# Altium schematic sheet RGB Video Output.SchDoc: SNES TST
size A4; DrawnBy: Opatus; DocumentNumber: 4; Revision: 0; SheetNumber: 4; SheetTotal: 4
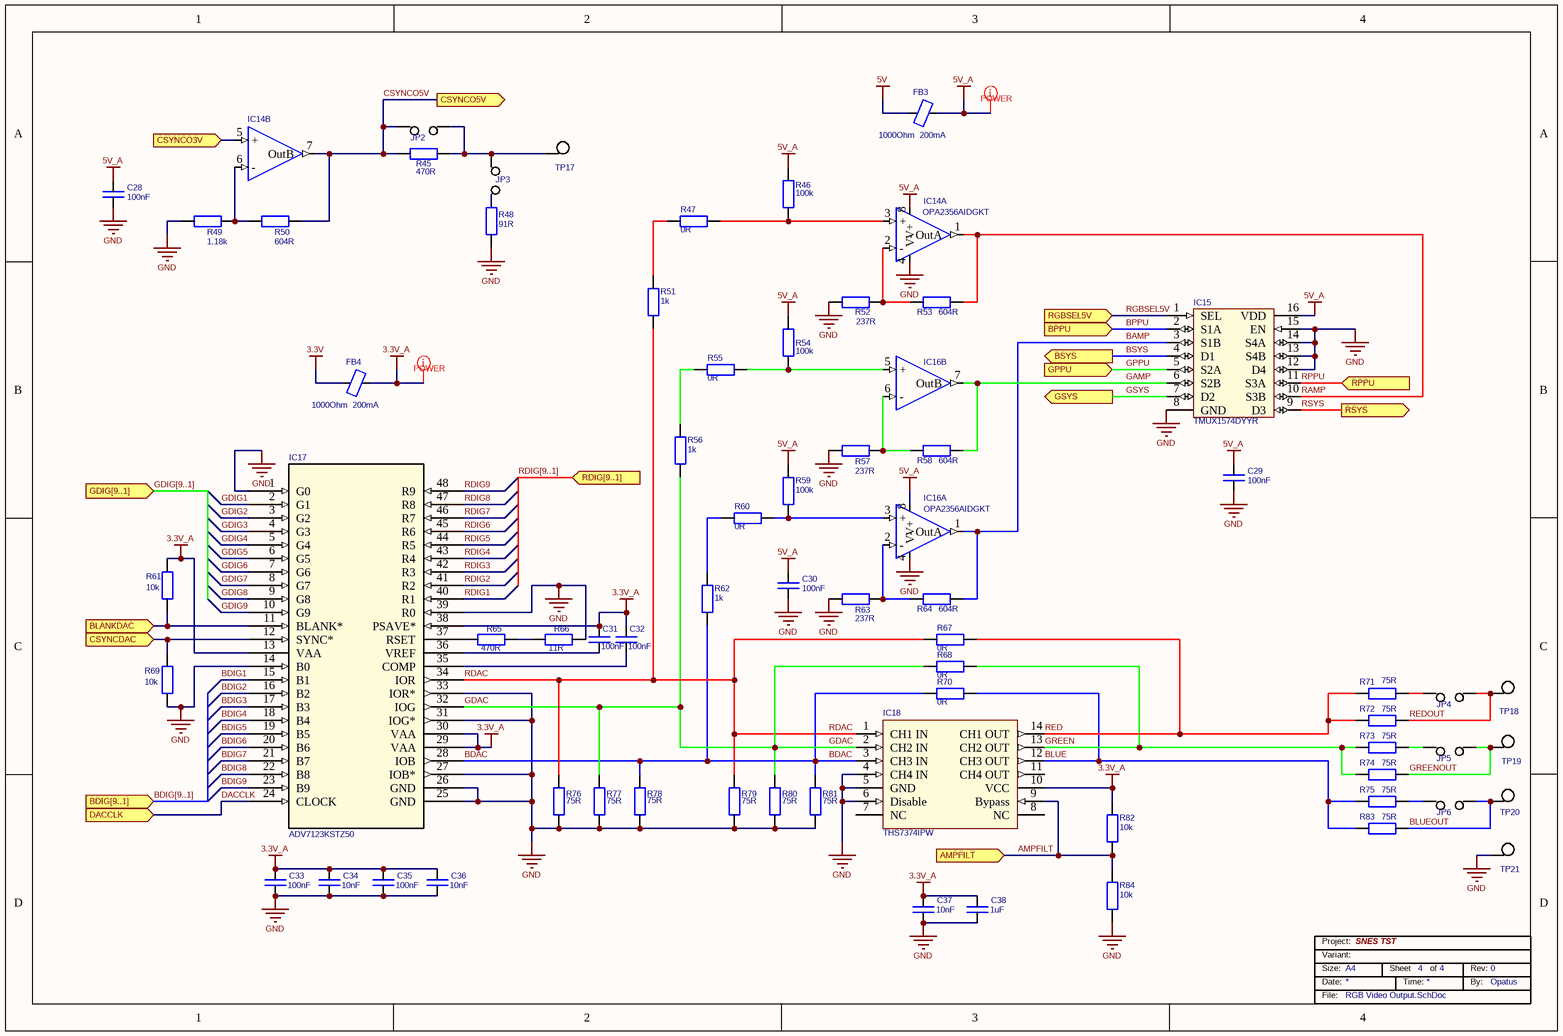
[diagram p0: RGB Video Output.SchDoc]

## Parts
C28  value 100nF  [Cap_0402_Chip]  (hidden comment: Ceramic Capacitor 100nF 10V ±20% X7R 0402)
C29  value 100nF  [Cap_0402_Chip]  (hidden comment: Ceramic Capacitor 100nF 10V ±20% X7R 0402)
C30  value 100nF  [Cap_0402_Chip]  (hidden comment: Ceramic Capacitor 100nF 10V ±20% X7R 0402)
C31  value 100nF  [Cap_0402_Chip]  (hidden comment: Ceramic Capacitor 100nF 10V ±20% X7R 0402)
C32  value 100nF  [Cap_0402_Chip]  (hidden comment: Ceramic Capacitor 100nF 10V ±20% X7R 0402)
C33  value 100nF  [Cap_0402_Chip]  (hidden comment: Ceramic Capacitor 100nF 10V ±20% X7R 0402)
C34  value 10nF  [Cap_0402_Chip]  (hidden comment: Ceramic Capacitor 10nF 10V ±20% X7R 0402)
C35  value 100nF  [Cap_0402_Chip]  (hidden comment: Ceramic Capacitor 100nF 10V ±20% X7R 0402)
C36  value 10nF  [Cap_0402_Chip]  (hidden comment: Ceramic Capacitor 10nF 10V ±20% X7R 0402)
C37  value 10nF  [Cap_0402_Chip]  (hidden comment: Ceramic Capacitor 10nF 10V ±20% X7R 0402)
C38  value 1uF  [Cap_0603_Chip]  (hidden comment: Ceramic Capacitor 1uF 10V ±20% X7R 0603)
FB3  1000Ohm  200mA  [Ind_0402_Chip]
FB4  1000Ohm  200mA  [Ind_0402_Chip]
IC14  Manufacturer_Part_Number: OPA2356AIDGKT  [MSOP8]  (hidden comment: OPA2356)  (parts A,B of 2)
IC15  Manufacturer_Part_Number: TMUX1574DYYR  [SOT-23THIN16]  (hidden comment: TMUX1574)
IC16  Manufacturer_Part_Number: OPA2356AIDGKT  [MSOP8]  (hidden comment: OPA2356)  (parts A,B of 2)
IC17  Manufacturer_Part_Number: ADV7123KSTZ50  [ST_48_ADI]  (hidden comment: ADV7123)
IC18  Manufacturer_Part_Number: THS7374IPW  [TSSOP14]  (hidden comment: THS7374)
JP2  Jumper  [Jumper]  (value not drawn)  (no BOM)
JP3  Jumper  [Jumper]  (value not drawn)  (no BOM)
JP4  Jumper  [Jumper]  (value not drawn)  (no BOM)
JP5  Jumper  [Jumper]  (value not drawn)  (no BOM)
JP6  Jumper  [Jumper]  (value not drawn)  (no BOM)
R45  value 470R  [Res_0603_Chip]  (hidden comment: Resistor 470R 0603 ±1%)
R46  value 100k  [Res_0402_Chip]  (hidden comment: Resistor 100k 0402 ±1%)
R47  value 0R  [Res_0402_Chip]  (hidden comment: Resistor 0R 0402)
R48  value 91R  [Res_0603_Chip]  (hidden comment: Resistor 91R 0603 ±1%)
R49  value 1.18k  [Res_0402_Chip]  (hidden comment: Resistor 1.18k 0402 ±1%)
R50  value 604R  [Res_0402_Chip]  (hidden comment: Resistor 604R 0402 ±1%)
R51  value 1k  [Res_0402_Chip]  (hidden comment: Resistor 1k 0402 ±1%)
R52  value 237R  [Res_0402_Chip]  (hidden comment: Resistor 237R 0402 ±1%)
R53  value 604R  [Res_0402_Chip]  (hidden comment: Resistor 604R 0402 ±1%)
R54  value 100k  [Res_0402_Chip]  (hidden comment: Resistor 100k 0402 ±1%)
R55  value 0R  [Res_0402_Chip]  (hidden comment: Resistor 0R 0402)
R56  value 1k  [Res_0402_Chip]  (hidden comment: Resistor 1k 0402 ±1%)
R57  value 237R  [Res_0402_Chip]  (hidden comment: Resistor 237R 0402 ±1%)
R58  value 604R  [Res_0402_Chip]  (hidden comment: Resistor 604R 0402 ±1%)
R59  value 100k  [Res_0402_Chip]  (hidden comment: Resistor 100k 0402 ±1%)
R60  value 0R  [Res_0402_Chip]  (hidden comment: Resistor 0R 0402)
R61  value 10k  [Res_0402_Chip]  (hidden comment: Resistor 10k 0402 ±1%)
R62  value 1k  [Res_0402_Chip]  (hidden comment: Resistor 1k 0402 ±1%)
R63  value 237R  [Res_0402_Chip]  (hidden comment: Resistor 237R 0402 ±1%)
R64  value 604R  [Res_0402_Chip]  (hidden comment: Resistor 604R 0402 ±1%)
R65  value 470R  [Res_0402_Chip]  (hidden comment: Resistor 470R 0402 ±1%)
R66  value 11R  [Res_0402_Chip]  (hidden comment: Resistor 11R 0402 ±1%)
R67  value 0R  [Res_0402_Chip]  (hidden comment: Resistor 0R 0402)
R68  value 0R  [Res_0402_Chip]  (hidden comment: Resistor 0R 0402)
R69  value 10k  [Res_0402_Chip]  (hidden comment: Resistor 10k 0402 ±1%)
R70  value 0R  [Res_0402_Chip]  (hidden comment: Resistor 0R 0402)
R71  value 75R  [Res_0603_Chip]  (hidden comment: Resistor 75R 0603 ±1%)
R72  value 75R  [Res_0603_Chip]  (hidden comment: Resistor 75R 0603 ±1%)
R73  value 75R  [Res_0603_Chip]  (hidden comment: Resistor 75R 0603 ±1%)
R74  value 75R  [Res_0603_Chip]  (hidden comment: Resistor 75R 0603 ±1%)
R75  value 75R  [Res_0603_Chip]  (hidden comment: Resistor 75R 0603 ±1%)
R76  value 75R  [Res_0402_Chip]  (hidden comment: Resistor 75R 0402 ±1%)
R77  value 75R  [Res_0402_Chip]  (hidden comment: Resistor 75R 0402 ±1%)
R78  value 75R  [Res_0402_Chip]  (hidden comment: Resistor 75R 0402 ±1%)
R79  value 75R  [Res_0402_Chip]  (hidden comment: Resistor 75R 0402 ±1%)
R80  value 75R  [Res_0402_Chip]  (hidden comment: Resistor 75R 0402 ±1%)
R81  value 75R  [Res_0402_Chip]  (hidden comment: Resistor 75R 0402 ±1%)
R82  value 10k  [Res_0402_Chip]  (hidden comment: Resistor 10k 0402 ±1%)
R83  value 75R  [Res_0603_Chip]  (hidden comment: Resistor 75R 0603 ±1%)
R84  value 10k  [Res_0402_Chip]  (hidden comment: Resistor 10k 0402 ±1%)
TP17  Pin Connector  [Pin Connector Small]  (value not drawn)  (no BOM)
TP18  Pin Connector  [Pin Connector Small]  (value not drawn)  (no BOM)
TP19  Pin Connector  [Pin Connector Small]  (value not drawn)  (no BOM)
TP20  Pin Connector  [Pin Connector Small]  (value not drawn)  (no BOM)
TP21  Pin Connector  [Pin Connector Small]  (value not drawn)  (no BOM)

## Ports
AMPFILT (in), BDIG[9..1] (in), BLANKDAC (in), BPPU (in), BSYS (out), CSYNCDAC (in), CSYNCO3V (in), CSYNCO5V (out), DACCLK (in), GDIG[9..1] (in), GPPU (in), GSYS (out), RDIG[9..1] (in), RGBSEL5V (in), RPPU (in), RSYS (out)

## Nets
3.3V: FB4.1
3.3V_A: C31.1 C32.1 C33.2 C34.2 C35.2 C36.2 C37.2 C38.2 FB4.2 IC17.13(VAA) IC17.29(VAA) IC17.30(VAA) IC17.38(PSAVE*) IC18.10(VCC) R61.2 R82.1
5V: FB3.1
5V_A: C28.1 C29.1 C30.1 FB3.2 IC14.8(V+) IC15.16(VDD) IC16.8(V+) R46.2 R54.2 R59.2
GND: C28.2 C29.2 C30.2 C33.1 C34.1 C35.1 C36.1 C37.1 C38.1 IC14.4(V-) IC15.8(GND) IC15.12(D4) IC15.13(S4B) IC15.14(S4A) IC15.15(EN) IC16.4(V-) IC17.1(G0) IC17.14(B0) IC17.25(GND) IC17.26(GND) IC17.27(IOB*) IC17.31(IOG*) IC17.33(IOR*) IC17.39(R0) IC18.4(CH4_IN) IC18.5(GND) IC18.6(Disable) R48.1 R49.1 R52.1 R57.1 R63.2 R66.2 R69.1 R76.1 R77.1 R78.1 R79.1 R80.1 R81.1 R84.2 TP21.1
AMPFILT: IC18.9(Bypass) R82.2 R84.1 ; port AMPFILT
BAMP: IC15.3(S1B) IC16.1(OutA) R64.2
BDAC: IC17.28(IOB) IC18.3(CH3_IN) R62.2 R70.2 R78.2 R81.2
BDIG1: IC17.15(B1)
BDIG2: IC17.16(B2)
BDIG3: IC17.17(B3)
BDIG4: IC17.18(B4)
BDIG5: IC17.19(B5)
BDIG6: IC17.20(B6)
BDIG7: IC17.21(B7)
BDIG8: IC17.22(B8)
BDIG9: IC17.23(B9)
BLANKDAC: IC17.11(BLANK*) R61.1 ; port BLANKDAC
BLUE: IC18.12(CH3_OUT) R70.1 R75.1 R83.1
BLUEOUT: JP6.1 R83.2 TP20.1
BPPU: IC15.2(S1A) ; port BPPU
BSYS: IC15.4(D1) ; port BSYS
CSYNCDAC: IC17.12(SYNC*) R69.2 ; port CSYNCDAC
CSYNCO3V: IC14.5(+) ; port CSYNCO3V
CSYNCO5V: IC14.7(OutB) JP2.2 R45.1 R50.1 ; port CSYNCO5V
DACCLK: IC17.24(CLOCK) ; port DACCLK
GAMP: IC15.6(S2B) IC16.7(OutB) R58.1
GDAC: IC17.32(IOG) IC18.2(CH2_IN) R56.2 R68.2 R77.2 R80.2
GDIG1: IC17.2(G1)
GDIG2: IC17.3(G2)
GDIG3: IC17.4(G3)
GDIG4: IC17.5(G4)
GDIG5: IC17.6(G5)
GDIG6: IC17.7(G6)
GDIG7: IC17.8(G7)
GDIG8: IC17.9(G8)
GDIG9: IC17.10(G9)
GPPU: IC15.5(S2A) ; port GPPU
GREEN: IC18.13(CH2_OUT) R68.1 R73.1 R74.1
GREENOUT: JP5.1 R74.2 TP19.1
GSYS: IC15.7(D2) ; port GSYS
RAMP: IC14.1(OutA) IC15.10(S3B) R53.2
RDAC: IC17.34(IOR) IC18.1(CH1_IN) R51.2 R67.2 R76.2 R79.2
RDIG1: IC17.40(R1)
RDIG2: IC17.41(R2)
RDIG3: IC17.42(R3)
RDIG4: IC17.43(R4)
RDIG5: IC17.44(R5)
RDIG6: IC17.45(R6)
RDIG7: IC17.46(R7)
RDIG8: IC17.47(R8)
RDIG9: IC17.48(R9)
RED: IC18.14(CH1_OUT) R67.1 R71.1 R72.1
REDOUT: JP4.1 R72.2 TP18.1
RGBSEL5V: IC15.1(SEL) ; port RGBSEL5V
RPPU: IC15.11(S3A) ; port RPPU
RSYS: IC15.9(D3) ; port RSYS
NetC31_2: C31.2 IC17.36(VREF)
NetC32_2: C32.2 IC17.35(COMP)
NetIC14_2: IC14.2(-) R52.2 R53.1
NetIC14_3: IC14.3(+) R46.1 R47.1
NetIC14_6: IC14.6(-) R49.2 R50.2
NetIC16_2: IC16.2(-) R63.1 R64.1
NetIC16_3: IC16.3(+) R59.1 R60.1
NetIC16_5: IC16.5(+) R54.1 R55.1
NetIC16_6: IC16.6(-) R57.2 R58.2
NetIC17_37: IC17.37(RSET) R65.1
NetJP2_1: JP2.1 JP3.1 R45.2 TP17.1
NetJP3_2: JP3.2 R48.2
NetJP4_2: JP4.2 R71.2
NetJP5_2: JP5.2 R73.2
NetJP6_2: JP6.2 R75.2
NetR47_2: R47.2 R51.1
NetR55_2: R55.2 R56.1
NetR60_2: R60.2 R62.1
NetR65_2: R65.2 R66.1

Not connected (* = marked no-connect by the designer): IC18 7(NC) 8(NC) 11(CH4_OUT)

## Buses and harness runs
bus BDIG[9..1] = port BDIG[9..1]
bus GDIG[9..1] = port GDIG[9..1]
bus RDIG[9..1] = port RDIG[9..1]

## Layout directives
net class POWER: 3.3V_A, 5V_A

## Notes on the sheet
- Size:
- Date:
- Variant:
- Project:
- A4
- Sheet
- Time:
- of
- Rev:
- By:
- File:

## Library data of the parts
C28-C37 = Capacitor: ChipSize: 0402; NominalVoltage: 10V; Dielectric: X7R; Tolerance: ±20%; PartType: Ceramic Capacitor
C38 = Capacitor: ChipSize: 0603; NominalVoltage: 10V; Dielectric: X7R; Tolerance: ±20%; PartType: Ceramic Capacitor
FB3 FB4 = Ferrite Bead: Manufacturer_Part_Number: MMZ1005S102CT000; Vendor: TDK; Value: 1000Ohm  200mA
IC14 IC16 = OPA2356: Vendor: Analog Devices
IC15 = TMUX1574: SPDT 4 Ch; Vendor: Texas Instruments
IC17 = ADV7123KSTZ140: 10Bit Video DAC; Vendor: Analog Devices Inc; Built_By: EMA_UL_Team; SourceLibrary: Analog_2012-01-01_8; Copyright: Copyright (C) 2018 Accelerated Designs. All rights reserved; RefDes: RefDes; Type: DEV
IC18 = THS7374: Vendor: Texas Instruments
R45 R48 R71-R75 R83 = R: ChipSize: 0603; Tolerance: ±1%; PartType: Resistor
R46 R47 R49-R70 R76-R82 R84 = R: ChipSize: 0402; PartType: Resistor
  R46 R49-R54 R56-R59 R61-R66 R69 R76-R82 R84: Tolerance: ±1%